# Altium schematic sheet TailLightPrototypeRev3.SchDoc
size A4; DocumentNumber: 3; SheetNumber: 3; SheetTotal: 4
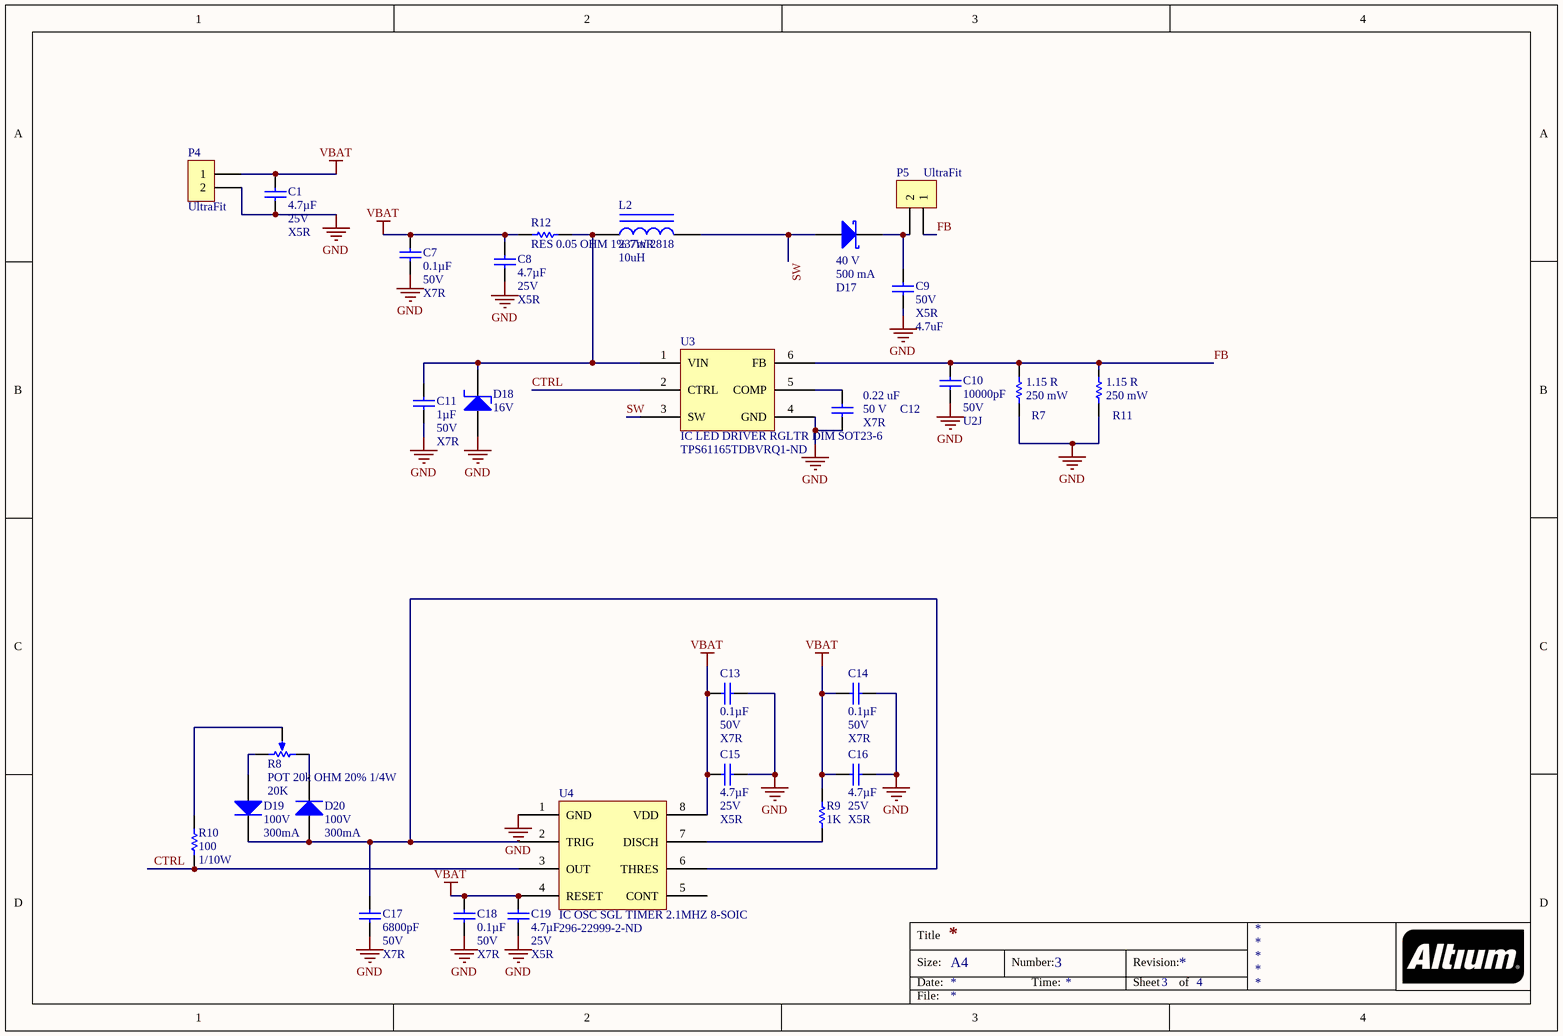
[diagram p0: TailLightPrototypeRev3.SchDoc]

## Parts
C1  Capacitance: 4.7µF  Voltage: 25V  Temperature Coefficient: X5R  [CAP, 0603]  (hidden comment: CAP CER 4.7UF 25V 10% X5R 0603)
C7  Capacitance: 0.1µF  Voltage: 50V  Temperature Coefficient: X7R  [CAP, 0603]  (hidden comment: CAP CER 0.1UF 50V 10% X7R 0603)
C8  Capacitance: 4.7µF  Voltage: 25V  Temperature Coefficient: X5R  [CAP, 0603]  (hidden comment: CAP CER 4.7UF 25V 10% X5R 0603)
C9  value 4.7uF  Voltage - Rated: 50V  Temperature Coefficient: X5R  [CAP, 0805]  (hidden comment: CAP CER 4.7UF 50V 10% X5R 0805)
C10  Capacitance: 10000pF  Voltage: 50V  Temperature Coefficient: U2J  [CAP, 0603]  (hidden comment: CAP CER 10nF 50V 5% X7R 0603)
C11  Capacitance: 1µF  Voltage: 50V  Temperature Coefficient: X7R  [CAP, 0603]  (hidden comment: CAP CER 1UF 50V 10% X7R 0603)
C12  CAP CER 0.22UF 50V X7R 0805  [CAP, 0805]  (value not drawn)
C13  Capacitance: 0.1µF  Voltage: 50V  Temperature Coefficient: X7R  [CAP, 0603]  (hidden comment: CAP CER 0.1UF 50V 10% X7R 0603)
C14  Capacitance: 0.1µF  Voltage: 50V  Temperature Coefficient: X7R  [CAP, 0603]  (hidden comment: CAP CER 0.1UF 50V 10% X7R 0603)
C15  Capacitance: 4.7µF  Voltage: 25V  Temperature Coefficient: X5R  [CAP, 0603]  (hidden comment: CAP CER 4.7UF 25V 10% X5R 0603)
C16  Capacitance: 4.7µF  Voltage: 25V  Temperature Coefficient: X5R  [CAP, 0603]  (hidden comment: CAP CER 4.7UF 25V 10% X5R 0603)
C17  Capacitance: 6800pF  Voltage: 50V  Temperature Coefficient: X7R  [CAP, 0603]  (hidden comment: CAP CER 6800pF 50V 10% X7R 0603)
C18  Capacitance: 0.1µF  Voltage: 50V  Temperature Coefficient: X7R  [CAP, 0603]  (hidden comment: CAP CER 0.1UF 50V 10% X7R 0603)
C19  Capacitance: 4.7µF  Voltage: 25V  Temperature Coefficient: X5R  [CAP, 0603]  (hidden comment: CAP CER 4.7UF 25V 10% X5R 0603)
D17  DIODE SCHOTTKY 40V 500MA SOD123  [SOD123]  (value not drawn)
D18  Voltage - Zener (Nom): 16V  [DO-214AA Diode]  (hidden comment: DIODE ZENER 16V 5W DO-214AA (SMB))
D19  Max Repetitive Reverse Voltage (Vrrm): 100V  Forward Current: 300mA  [DIODE GEN PURP 100V 300MA SOD123]  (hidden comment: DIODE GEN PURP 100V 300MA SOD123)
D20  Max Repetitive Reverse Voltage (Vrrm): 100V  Forward Current: 300mA  [DIODE GEN PURP 100V 300MA SOD123]  (hidden comment: DIODE GEN PURP 100V 300MA SOD123)
L2  DC Resistance (DCR): 237mR  Inductance: 10uH  [INDP5050X20N]  (hidden comment: FIXED IND 10UH 1.13A 237 MOHM)
P4  Series: UltraFit  [CONN, 2POS ULTRA-FIT]  (hidden comment: CONN 2POS ULTRA-FIT 0.138")
P5  Series: UltraFit  [CONN, 2POS ULTRA-FIT]  (hidden comment: CONN 2POS ULTRA-FIT 0.138")
R7  RES SMD 1.15 OHM 1% 1/4W 1206  [RES 1206]  (value not drawn)
R8  POT 20k OHM 20% 1/4W  value 20K  [20K POT]
R9  1K  [RES, 0603]
R10  Resistance: 100  Power: 1/10W  [RES, 0603]  (hidden comment: RES 100 OHM 1% 1/10W 0603)
R11  RES SMD 1.15 OHM 1% 1/4W 1206  [RES 1206]  (value not drawn)
R12  RES 0.05 OHM 1% 7W 2818  [RES 2818]
U3  IC LED DRIVER RGLTR DIM SOT23-6  Supplier Part Number 1: TPS61165TDBVRQ1-ND  [SOT23-6_N]
U4  IC OSC SGL TIMER 2.1MHZ 8-SOIC  Supplier Part Number 1: 296-22999-2-ND  [SOIC8]

## Nets
GND: C1.2 C7.2 C8.2 C9.2 C10.2 C11.2 C12.2 C13.1 C14.1 C15.1 C16.1 C17.2 C18.2 C19.2 D18.1(A) P4.2 R7.2 R11.2 U3.4(GND) U4.1(GND)
VBAT: C1.1 C7.1 C8.1 C13.2 C14.2 C15.2 C16.2 C18.1 C19.1 P4.1 R9.1 R12.1 U4.4(RESET) U4.8(VDD)
CTRL: R10.2 U3.2(CTRL) U4.3(OUT)
FB: C10.1 P5.1 R7.1 R11.1 U3.6(FB)
SW: D17.1(A) L2.2 U3.3(SW)
NetC9_1: C9.1 D17.2(K) P5.2
NetC11_1: C11.1 D18.2(K) L2.1 R12.2 U3.1(VIN)
NetC12_1: C12.1 U3.5(COMP)
NetC17_1: C17.1 D19.2(K) D20.1(A) U4.2(TRIG) U4.6(THRES)
NetD19_1: D19.1(A) R8.3(BOT)
NetD20_2: D20.2(K) R8.1(TOP)
NetR8_2: R8.2(TAP) R10.1
NetR9_2: R9.2 U4.7(DISCH)

Not connected (* = marked no-connect by the designer): U4 5(CONT)

## Notes on the sheet
- Title
- Size:
- Date:
- A4
- Number:
- Time:
- Revision:
- Sheet
- of
- File:
- (in symbol CAP CER 0.22UF 50V X7R 0805) 0.22 uF; 50 V
- (in symbol DIODE SCHOTTKY 40V 500MA SOD123) 40 V; 500 mA
- (in symbol RES SMD 1.15 OHM 1% 1/4W 1206) 1.15 R; 250 mW

## Library data of the parts
C1 C8 C15 C16 C19 = CAP CER 4.7UF 25V 10% X5R 0603: 4.7µF ±10% 25V Ceramic Capacitor X5R 0603 (1608 Metric); Manufacturer 1: Murata Electronics North America; Manufacturer Part Number 1: GRM188R61E475KE11D; Supplier 1: Digi-Key; Supplier Part Number 1: 490-7203-1-ND; Packaging: Cut Tape (CT); Part Status: Active; Operating Temperature: -55°C ~ 85°C; Ratings: -; Mounting Type: Surface Mount, MLCC; Package / Case: 0603 (1608 Metric); Size / Dimension: 0.063" L x 0.031" W (1.60mm x 0.80mm); Height - Seated (Max): -; Thickness (Max): 0.031" (0.80mm); Lead Spacing: -; Lead Style: -; ComponentLink1URL: http://www.murata.com/~/media/webrenewal/support/library/catalog/products/capacitor/mlcc/c02e.ashx; ComponentLink1Description: http://www.murata.com/~/media/webrenewal/support/library/catalog/products/capacitor/mlcc/c02e.ashx; Tolerance: ±10%
C7 C13 C14 C18 = CAP CER 0.1UF 50V 10% X7R 0603: 0.10µF ±10% 50V Ceramic Capacitor X7R 0603 (1608 Metric); Manufacturer 1: AVX Corporation; Manufacturer Part Number 1: 06035C104KAT2A; Supplier 1: Digi-Key; Supplier Part Number 1: 478-5052-1-ND; Packaging: Cut Tape (CT); Part Status: Active; Operating Temperature: -55°C ~ 125°C; Ratings: -; Mounting Type: Surface Mount, MLCC; Package / Case: 0603 (1608 Metric); Size / Dimension: 0.063" L x 0.032" W (1.60mm x 0.81mm); Height - Seated (Max): -; Thickness (Max): 0.035" (0.90mm); Lead Spacing: -; Lead Style: -; ComponentLink1URL: http://datasheets.avx.com/X7RDielectric.pdf; ComponentLink1Description: http://datasheets.avx.com/X7RDielectric.pdf; Tolerance: ±10%
C9 = CAP CER 4.7UF 50V 10% X5R 0805: 4.7µF ±20% 50V Ceramic Capacitor X5R 0805 (2012 Metric); Manufacturer 1: Murata Electronics North America; Manufacturer Part Number 1: GRT21BR61H475ME13L; Description 1: CAP CER 4.7UF 50V X5R 0805; Supplier 1: Digi-Key; Supplier Part Number 1: 490-12395-1-ND; RoHS: RoHS Compliant; Category: Capacitors; Stock 1: 4286; Pricing 1: 1=0.56, 10=0.389, 100=0.2338, 500=0.17536, 1000=0.14808 (CAD); Packaging: Cut Tape (CT); Part Status: Active; Tolerance: ±20%; Operating Temperature: -55°C ~ 85°C; Features: -; Ratings: AEC-Q200; Applications: Automotive; Mounting Type: Surface Mount, MLCC; Package / Case: 0805 (2012 Metric); Size / Dimension: 0.079" L x 0.049" W (2.00mm x 1.25mm); Height - Seated (Max): -; Thickness (Max): 0.057" (1.45mm); Lead Spacing: -; Lead Style: -; ComponentLink1URL: http://search.murata.co.jp/Ceramy/image/img/A01X/G101/ENG/GRT21BR61H475ME13-01.pdf; ComponentLink1Description: http://search.murata.co.jp/Ceramy/image/img/A01X/G101/ENG/GRT21BR61H475ME13-01.pdf
C10 = CAP CER 10nF 50V 5% X7R 0603: 10000pF ±5% 50V Ceramic Capacitor U2J 0603 (1608 Metric); Manufacturer 1: KEMET; Manufacturer Part Number 1: C0603C103J5JAC7867; Supplier 1: Digi-Key; Supplier Part Number 1: 399-13384-1-ND; Packaging: Cut Tape (CT); Part Status: Active; Operating Temperature: -55°C ~ 125°C; Ratings: -; Failure Rate: -; Mounting Type: Surface Mount, MLCC; Package / Case: 0603 (1608 Metric); Size / Dimension: 0.063" L x 0.032" W (1.60mm x 0.80mm); Height - Seated (Max): -; Thickness (Max): 0.034" (0.87mm); Lead Spacing: -; Lead Style: -; ComponentLink1URL: http://www.kemet.com/docfinder?Partnumber=C0603C103J5JAC7867; ComponentLink1Description: http://www.kemet.com/docfinder?Partnumber=C0603C103J5JAC7867; Tolerance: ±5%
C11 = CAP CER 1UF 50V 10% X7R 0603: 1µF ±10% 50V Ceramic Capacitor X7R 0603 (1608 Metric); Manufacturer 1: Taiyo Yuden; Manufacturer Part Number 1: UMK107AB7105KA-T; Supplier 1: Digi-Key; Supplier Part Number 1: 587-3247-1-ND; Packaging: Cut Tape (CT); Part Status: Active; Operating Temperature: -55°C ~ 125°C; Ratings: -; Mounting Type: Surface Mount, MLCC; Package / Case: 0603 (1608 Metric); Size / Dimension: 0.063" L x 0.031" W (1.60mm x 0.80mm); Height - Seated (Max): -; Thickness (Max): 0.037" (0.95mm); Lead Spacing: -; Lead Style: -; ComponentLink1URL: http://www.yuden.co.jp/productdata/catalog/en/mlcc_all_e.pdf; ComponentLink1Description: http://www.yuden.co.jp/productdata/catalog/en/mlcc_all_e.pdf; Tolerance: ±10%
C12 = CAP CER 0.22UF 50V X7R 0805: Manufacturer: Samsung; Manufacturer Part Number: CL21B224KBFNNNE; Tolerance: 10%; Capacitance: 220nF; Supplier 1: Digi-Key; Stock 1: 219478; Pricing 1: 1=0.11, 10=0.077, 100=0.0361, 500=0.02532, 1000=0.02096 (USD); Mount: Surface Mount; Case/Package: 0805; Case Code (Metric): 2012; Case Code (Imperial): 0805; Contact Plating: Tin; Min Operating Temperature: -55°C; Max Operating Temperature: 125°C; Voltage Rating: 50V; Package Quantity: 1; Packaging: Tape and Reel; Dielectric: X7R; Voltage Rating (DC): 50V; Voltage: 50V; Length: 2mm; Height: 1.25mm; Width: 0.049inch; Thickness: 0.053inch; Depth: 1.25mm; Radiation Hardening: No; Lead Free: Lead Free; ComponentLink1URL: https://www.verical.com/server-webapp/html/getDatasheet?partID=358363&src-supplier=Verical; ComponentLink1Description: https://www.verical.com/server-webapp/html/getDatasheet?partID=358363&src-supplier=Verical; Supplier Part Number 1: 1276-1093-6-ND
C17 = CAP CER 6800pF 50V 10% X7R 0603: 6800pF ±10% 50V Ceramic Capacitor X7R 0603 (1608 Metric); Manufacturer 1: Samsung Electro-Mechanics America, Inc.; Manufacturer Part Number 1: CL10B682KB8SFNC; Supplier 1: Digi-Key; Supplier Part Number 1: 1276-2103-1-ND; Packaging: Cut Tape (CT); Part Status: Active; Operating Temperature: -55°C ~ 125°C; Ratings: -; Mounting Type: Surface Mount, MLCC; Package / Case: 0603 (1608 Metric); Size / Dimension: 0.063" L x 0.031" W (1.60mm x 0.80mm); Height - Seated (Max): -; Thickness (Max): 0.035" (0.90mm); Lead Spacing: -; Lead Style: -; ComponentLink1URL: http://www.samsungsem.com/kr/support/product-search/mlcc/CL10B682KB8SFNC.jsp; ComponentLink1Description: http://www.samsungsem.com/kr/support/product-search/mlcc/CL10B682KB8SFNC.jsp; Tolerance: ±10%
D17 = DIODE SCHOTTKY 40V 500MA SOD123: Diode Schottky 40V 500mA Surface Mount SOD-123; Manufacturer: ON Semiconductor / Fairchild; Manufacturer Part Number: MBR0540; Peak Reverse Current: 20uA; Max Surge Current: 5.5A; Forward Voltage: 620mV; Power Dissipation: 400mW; Element Configuration: Single; Polarity: Standard; Current Rating: 500A; ComponentLink1Description: datasheet; ComponentLink1URL: https://www.onsemi.cn/PowerSolutions/document/MBR0540-D.pdf; ComponentLink2Description: supplier link; ComponentLink2URL: https://www.onsemi.com/PowerSolutions/product.do?id=MBR0540; Supplier 1: Digi-Key; Stock 1: 414620; Pricing 1: 1=0.2, 10=0.166, 100=0.0881, 500=0.05794, 1000=0.0394 (USD); Mount: Surface Mount; Number of Pins: 2; Weight: 0.03g; Contact Plating: Tin,Matte; Min Operating Temperature: -65°C; Max Operating Temperature: 125°C; Forward Current: 500mA; Package Quantity: 3000; Packaging: Tape and Reel; Average Rectified Current: 500mA; Max Reverse Leakage Current: 20uA; Max Repetitive Reverse Voltage (Vrrm): 40V; Peak Non-Repetitive Surge Current: 5.5A; Max Forward Surge Current (Ifsm): 5.5A; Voltage Rating (DC): 40V; Output Current: 500mA; Max Reverse Voltage (DC): 40V; Length: 2.7mm; Height: 1.03mm; Width: 1.6mm; Radiation Hardening: No; REACH SVHC: No SVHC; Lead Free: Lead Free; ComponentLink3URL: https://www.fairchildsemi.com/datasheets/MB/MBR0540.pdf?src-supplier=Digi-Key; ComponentLink3Description: https://www.fairchildsemi.com/datasheets/MB/MBR0540.pdf?src-supplier=Digi-Key; ComponentLink4URL: https://www.onsemi.cn/PowerSolutions/document/MBR0540-D.pdf?src-supplier=Digi-Key; ComponentLink4Description: https://www.onsemi.cn/PowerSolutions/document/MBR0540-D.pdf?src-supplier=Digi-Key; ComponentLink5URL: http://www.jameco.com/Jameco/Products/ProdDS/975060.pdf?src-supplier=Jameco; ComponentLink5Description: http://www.jameco.com/Jameco/Products/ProdDS/975060.pdf?src-supplier=Jameco; ComponentLink6URL: http://www.mouser.com/ds/2/149/MBR0540-90522.pdf?src-supplier=Mouser; ComponentLink6Description: http://www.mouser.com/ds/2/149/MBR0540-90522.pdf?src-supplier=Mouser; ComponentLink7URL: https://www.verical.com/server-webapp/html/getDatasheet?partID=110131&src-supplier=Verical; ComponentLink7Description: https://www.verical.com/server-webapp/html/getDatasheet?partID=110131&src-supplier=Verical; ComponentLink8URL: http://www.farnell.com/datasheets/2041480.pdf?src-supplier=Element14; ComponentLink8Description: http://www.farnell.com/datasheets/2041480.pdf?src-supplier=Element14; ComponentLink9URL: https://www.fairchildsemi.com/datasheets/MB/MBR0540.pdf?src-supplier=Avnet; ComponentLink9Description: https://www.fairchildsemi.com/datasheets/MB/MBR0540.pdf?src-supplier=Avnet; Supplier Part Number 1: MBR0540DKR-ND
D18 = DIODE ZENER 16V 5W DO-214AA (SMB): Zener Diode 16V 5W ±5% Surface Mount DO-214AA (SMB); Manufacture: Micro Commercial Co; Manufacture Part Number: SMBJ5353B-TP; Impedence (Max): 2.5 Ohm; Voltage - Forward: 1.2V @ 1A; Power (Max): 5W; Supplier 1: Digi-Key; Supplier Part Number 1: SMBJ5353B-TPMSCT-ND
D19 D20 = DIODE GEN PURP 100V 300MA SOD123: Diode Standard 100V 300mA (DC) Surface Mount SOD-123; Manufacturer: Diodes Zetex; Manufacturer Part Number: 1N4148WQ-7-F; Max Surge Current: 2A; Forward Voltage: 1.25V; Element Configuration: Single; Recovery Time: 4ns; Peak Reverse Current: 50uA; Max Power Dissipation: 400mW; Supplier 1: Digi-Key; Stock 1: 229; Pricing 1: 1=0.22, 10=0.196, 100=0.107, 500=0.0658, 1000=0.0449 (USD); Mount: Surface Mount; Case/Package: SOD-123-2; Number of Pins: 2; Weight: 0.000353oz; Contact Plating: Tin,Matte; Min Operating Temperature: -65°C; Max Operating Temperature: 150°C; Packaging: Tape and Reel; Peak Non-Repetitive Surge Current: 2A; Package Quantity: 3000; Reverse Recovery Time: 4ns; Lead Free: Lead Free; ComponentLink1URL: http://components.arrow.com/part/dataview/0323_07206809; ComponentLink1Description: http://components.arrow.com/part/dataview/0323_07206809; ComponentLink2URL: http://www.diodes.com/datasheets/ds30086.pdf; ComponentLink2Description: http://www.diodes.com/datasheets/ds30086.pdf; ComponentLink3URL: http://www.mouser.com/ds/2/115/ds30086-318161.pdf; ComponentLink3Description: http://www.mouser.com/ds/2/115/ds30086-318161.pdf; Supplier Part Number 1: 1N4148WQ-7-FDICT-ND
L2 = FIXED IND 10UH 1.13A 237 MOHM: 10µH Shielded Wirewound Inductor 1.13A 237mOhm Max Nonstandard; Manufacturer: TDK; Manufacturer Part Number: VLCF5020T-100M1R1-1; Core Material: Ferrite; Inductance Tolerance: 20%; Test Frequency: 100kHz; RMS Current (Irms): 1.5A; Supplier 1: Digi-Key; Stock 1: 12500; Pricing 1: 500=0.441, 1000=0.357, 2500=0.336, 5000=0.3255, 12500=0.315, 25000=0.3045 (USD); Mount: Surface Mount; Case/Package: 2020; Number of Pins: 2; Min Operating Temperature: -40°C; Max Operating Temperature: 105°C; Packaging: Tape and Reel; Tolerance: 20%; Package Quantity: 500; Current Rating: 1.13A; Saturation Current: 1.13A; Shielding: Shielded; Composition: Wirewound; Max DC Current: 1.13A; Termination: SMD/SMT; DC Current: 1.13A; Military Standard: Not; Length: 0.197inch; Height: 2mm; Width: 0.197inch; Height - Seated (Max): 0.079inch; Depth: 5.2mm; Radiation Hardening: No; REACH SVHC: No SVHC; Lead Free: Lead Free; ComponentLink1URL: http://www.onlinecomponents.com/productFiles/mf-TDK/e531_vlcf5020_1.pdf?src-supplier=Onlinecomponents.com; ComponentLink1Description: http://www.onlinecomponents.com/productFiles/mf-TDK/e531_vlcf5020_1.pdf?src-supplier=Onlinecomponents.com; ComponentLink2URL: http://www.mouser.com/ds/2/400/e531_vlcf-18500.pdf?src-supplier=Mouser; ComponentLink2Description: http://www.mouser.com/ds/2/400/e531_vlcf-18500.pdf?src-supplier=Mouser; ComponentLink3URL: http://www.farnell.com/datasheets/516785.pdf?src-supplier=Element14; ComponentLink3Description: http://www.farnell.com/datasheets/516785.pdf?src-supplier=Element14; ComponentLink4URL: http://uk.rs-online.com/webdocs/1538/0900766b81538dbe.pdf?src-supplier=RSComponents; ComponentLink4Description: http://uk.rs-online.com/webdocs/1538/0900766b81538dbe.pdf?src-supplier=RSComponents; ComponentLink5URL: https://www.verical.com/server-webapp/html/getDatasheet?partID=107508&src-supplier=Verical; ComponentLink5Description: https://www.verical.com/server-webapp/html/getDatasheet?partID=107508&src-supplier=Verical; Supplier Part Number 1: 445-3209-2-ND
P4 = CONN 2POS ULTRA-FIT 0.138": Connector Header Through Hole 2 position 0.138" (3.50mm); Manufacturer: Molex; Manufacturer Part Number: 1722871102; Number of Positions: 2; Connector Type: Male Pin; Pitch: 0.138inch; ComponentLink1URL: http://www.molex.com/pdm_docs/sd/1722861302_sd.pdf; ComponentLink1Description: http://www.molex.com/pdm_docs/sd/1722861302_sd.pdf; Supplier 1: Digi-Key; RoHS: Yes; Stock 1: 2743; Pricing 1: 1 = 0.78000, 10 = 0.68800, 100 = 0.59380, 500 = 0.48582, 1000 = 0.43184, 5000 = 0.37786, 10000 = 0.35897 (USD); Mount: Through Hole; Color: Black; Contact Plating: Tin; Packaging: Tray; Number of Rows: 1; Termination: Solder; Fastening Type: Latch; Supplier Part Number 1: WM11701-ND
P5 = CONN 2POS ULTRA-FIT 0.138": 2 Positions Header, Shrouded Connector 0.138" (3.50mm) Through Hole Gold; Manufacturer 1: Molex, LLC; Manufacturer Part Number 1: 1722861302; Style: Board to Board or Cable; Shrouding: Shrouded - 4 Wall; Number of Positions: 2; Number of Positions Loaded: All; Contact Length - Post: 0.126" (3.20mm); Material Flammability Rating: UL94 V-0; Mated Stacking Heights: 26.99mm; Voltage: 400V; Supplier 1: Digi-Key; Supplier Part Number 1: WM11673-ND; Packaging: Tray; Part Status: Active; Connector Type: Header; Contact Type: Male Pin; Pitch - Mating: 0.138" (3.50mm); Number of Rows: 1; Row Spacing - Mating: -; Mounting Type: Through Hole; Termination: Kinked Pin, Solder; Fastening Type: Latch Holder; Contact Length - Mating: -; Overall Contact Length: -; Insulation Height: 0.465" (11.80mm); Contact Shape: Square; Contact Finish - Mating: Gold; Contact Finish Thickness - Mating: 30µin (0.76µm); Contact Finish - Post: Tin; Contact Material: Copper Alloy; Insulation Material: Liquid Crystal Polymer (LCP); Operating Temperature: -40°C ~ 120°C; Ingress Protection: -; Insulation Color: Black; Current Rating: -; Contact Finish Thickness - Post: 60µin (1.52µm); ComponentLink1URL: http://www.molex.com/pdm_docs/sd/1722861302_sd.pdf; ComponentLink1Description: http://www.molex.com/pdm_docs/sd/1722861302_sd.pdf
R7 R11 = RES SMD 1.15 OHM 1% 1/4W 1206: Manufacturer: Yageo; Manufacturer Part Number: RC1206FR-071R15L; Resistance: 1.15R; Temperature Coefficient: 200ppm/°C; Voltage Rating (DC): 200V; Supplier 1: Digi-Key; Stock 1: 34622; Pricing 1: 1=0.15, 10=0.133, 100=0.0512, 1000=0.02252, 2500=0.01945 (USD); Case/Package: 1206; Contact Plating: Tin,Matte; Min Operating Temperature: -55°C; Max Operating Temperature: 155°C; Tolerance: 1%; Composition: Thick Film; Radiation Hardening: No; Lead Free: Lead Free; Supplier Part Number 1: 311-1.15FRDKR-ND
R8 = POT 20k OHM 20% 1/4W: 20k Ohm 0.25W, 1/4W Gull Wing Surface Mount Trimmer Potentiometer; Manufacture: TT Electronics/BI; Manufacture Part Number: 23BR20KLFTR; Adjustment Type: Top; Turns: 1; Power: 1/4W; Tolerence: 20%; Supplier 1: Digi-Key; Supplier Part Number 1: 987-1016-1-ND
R9 = RES 1K OHM 5% 1/10W 0603: 1k Ohm ±5% 0.1W, 1/10W Chip Resistor 0603 (1608 Metric); Manufacturer: Yageo; Manufacturer Part Number: RC0603JR-071KL; Temperature Coefficient: ±100ppm/°C; Supplier 1: Digi-Key; Supplier Part Number 1: 311-1.0KGRCT-ND; RoHS: RoHS Compliant; Category: Resistors; Stock 1: 4415240; Pricing 1: 1=0.15, 10=0.017, 100=0.0071, 1000=0.0032, 2500=0.00278 (CAD); Packaging: Cut Tape (CT); Part Status: Active; Resistance (Ohms): 1k; Tolerance: ±5%; Power (Watts): 0.1W, 1/10W; Composition: Thick Film; Features: Moisture Resistant; Operating Temperature: -55°C ~ 155°C; Package / Case: 0603 (1608 Metric); Supplier Device Package: 0603; Size / Dimension: 0.063" L x 0.031" W (1.60mm x 0.80mm); Height - Seated (Max): 0.022" (0.55mm); Failure Rate: -; ComponentLink1URL: http://www.yageo.com/documents/recent/PYu-RC_Group_51_RoHS_L_7.pdf; ComponentLink1Description: http://www.yageo.com/documents/recent/PYu-RC_Group_51_RoHS_L_7.pdf
R10 = RES 100 OHM 1% 1/10W 0603: 100 Ohm ±1% 0.1W, 1/10W Chip Resistor 0603 (1608 Metric) Moisture Resistant Thick Film; Manufacturer 1: Yageo; Manufacturer Part Number 1: RC0603FR-07100RL; Temperature Coefficient: ±100ppm/°C; Supplier 1: Digi-Key; Supplier Part Number 1: 311-100HRCT-ND; Packaging: Cut Tape (CT); Part Status: Active; Composition: Thick Film; Operating Temperature: -55°C ~ 155°C; Package / Case: 0603 (1608 Metric); Supplier Device Package: 0603; Size / Dimension: 0.063" L x 0.031" W (1.60mm x 0.80mm); Height - Seated (Max): 0.022" (0.55mm); Failure Rate: -; ComponentLink1URL: http://www.yageo.com/documents/recent/PYu-RC_Group_51_RoHS_L_7.pdf; ComponentLink1Description: http://www.yageo.com/documents/recent/PYu-RC_Group_51_RoHS_L_7.pdf; Tolerance: ±1%
R12 = RES 0.05 OHM 1% 7W 2818: 50 mOhms ±1% 7W Chip Resistor Nonstandard Automotive AEC-Q200, Current Sense, Moisture Resistant, Pulse Withstanding Metal Element; Manufacturer 1: Vishay Dale; Manufacturer Part Number 1: WSHM2818R0500FEA; Resistance: 50mR; Temperature Coefficient: 75ppm/°C; Supplier 1: Digi-Key; Stock 1: 2548; Pricing 1: 1=1.41000, 10=1.25300, 25=1.15200, 50=1.05100, 100=0.90960, 250=0.76808, 500=0.64680, 1000=0.53765 (USD); RoHS: Yes; Case/Package: 2818; Min Operating Temperature: -65°C; Max Operating Temperature: 170°C; Packaging: Tape and Reel; Composition: Metal Element; Number of Terminations: 2; Tolerance: 1%; Max Power Dissipation: 7W; Features: Moisture Resistant,Automotive AEC-Q200; Length: 0.28inch; Height: 0.069inch; Width: 0.181inch; ComponentLink1URL: http://www.mouser.com/ds/2/427/wshm2818-469484.pdf?src-supplier=Mouser; ComponentLink1Description: http://www.mouser.com/ds/2/427/wshm2818-469484.pdf?src-supplier=Mouser; ComponentLink2URL: http://www.vishay.com/docs/30188/wshm2818.pdf?src-supplier=Digi-Key; ComponentLink2Description: http://www.vishay.com/docs/30188/wshm2818.pdf?src-supplier=Digi-Key; ComponentLink3URL: http://www.vishay.com/docs/49536/_wshm2818_vmn-pt0284.pdf?src-supplier=Digi-Key; ComponentLink3Description: http://www.vishay.com/docs/49536/_wshm2818_vmn-pt0284.pdf?src-supplier=Digi-Key; Supplier Part Number 1: 541-2633-1-ND
U3 = IC LED DRIVER RGLTR DIM SOT23-6: LED Driver IC 1 Output DC DC Regulator Step-Up (Boost) PWM Dimming 1.2A (Switch) SOT-23-6; Manufacturer: Texas Instruments; Manufacturer Part Number: TPS61165TDBVRQ1; Number of Outputs: 1; Max Supply Voltage: 18V; Frequency: 1.2MHz; Min Input Voltage: 3V; Output Voltage: 38V; Number of Segments: 3; Max Supply Current: 2.3mA; Quiescent Current: 1.5mA; ComponentLink1Description: datasheet; ComponentLink1URL: http://www.ti.com/lit/ds/symlink/tps61165.pdf; Supplier 1: Digi-Key; Stock 1: 0; Case/Package: SOT-23-6; Number of Pins: 6; Min Operating Temperature: -40°C; Max Operating Temperature: 105°C; Packaging: Tape and Reel; Topology: Boost; Max Input Voltage: 18V; Output Current per Channel: 1.2A; Output Current: 1.2A; Package Quantity: 3000; Dimming: PWM; Min Supply Voltage: 3V; Number of Channels: 1; Radiation Hardening: No; Lead Free: Lead Free; ComponentLink2URL: http://www.ti.com/lit/gpn/tps61165-q1?src-supplier=Mouser; ComponentLink2Description: http://www.ti.com/lit/gpn/tps61165-q1?src-supplier=Mouser; ComponentLink3URL: https://www.verical.com/server-webapp/html/getDatasheet?partID=676299&src-supplier=Verical; ComponentLink3Description: https://www.verical.com/server-webapp/html/getDatasheet?partID=676299&src-supplier=Verical; ComponentLink4URL: http://www.ti.com/lit/ds/symlink/tps61165-q1.pdf?src-supplier=Digi-Key; ComponentLink4Description: http://www.ti.com/lit/ds/symlink/tps61165-q1.pdf?src-supplier=Digi-Key
U4 = IC OSC SGL TIMER 2.1MHZ 8-SOIC: 555 Type, Timer/Oscillator (Single) IC 2.1MHz 8-SOIC; Manufacturer: Texas Instruments; Manufacturer Part Number: TLC555QDRQ1; Max Power Dissipation: 725mW; Min Supply Voltage: 2V; Max Supply Voltage: 15V; Nominal Supply Current: 170uA; Number of Timers/Counters: 1; Operating Supply Current: 360uA; High Level Output Current: -10mA; Low Level Output Current: 100mA; Supplier 1: Digi-Key; Stock 1: 60000; Pricing 1: 2500=0.3528, 5000=0.33516, 12500=0.32256 (USD); Mount: Surface Mount; Case/Package: SOIC; Number of Pins: 8; Weight: 0.002561oz; Contact Plating: Gold; Min Operating Temperature: -40°C; Max Operating Temperature: 125°C; Packaging: Tape and Reel; Package Quantity: 2500; Frequency: 2.1MHz; Power Dissipation: 725mW; Quiescent Current: 170uA; Radiation Hardening: No; REACH SVHC: No SVHC; Lead Free: Lead Free; ComponentLink1URL: http://focus.ti.com/lit/ds/symlink/tlc555-q1.pdf?src-supplier=Avnet; ComponentLink1Description: http://focus.ti.com/lit/ds/symlink/tlc555-q1.pdf?src-supplier=Avnet; ComponentLink2URL: http://www.farnell.com/datasheets/1806066.pdf?src-supplier=Element14; ComponentLink2Description: http://www.farnell.com/datasheets/1806066.pdf?src-supplier=Element14; ComponentLink3URL: https://www.verical.com/server-webapp/html/getDatasheet?partID=297376&src-supplier=Verical; ComponentLink3Description: https://www.verical.com/server-webapp/html/getDatasheet?partID=297376&src-supplier=Verical; ComponentLink4URL: http://www.ti.com/lit/ds/symlink/tlc555-q1.pdf?src-supplier=Digi-Key; ComponentLink4Description: http://www.ti.com/lit/ds/symlink/tlc555-q1.pdf?src-supplier=Digi-Key